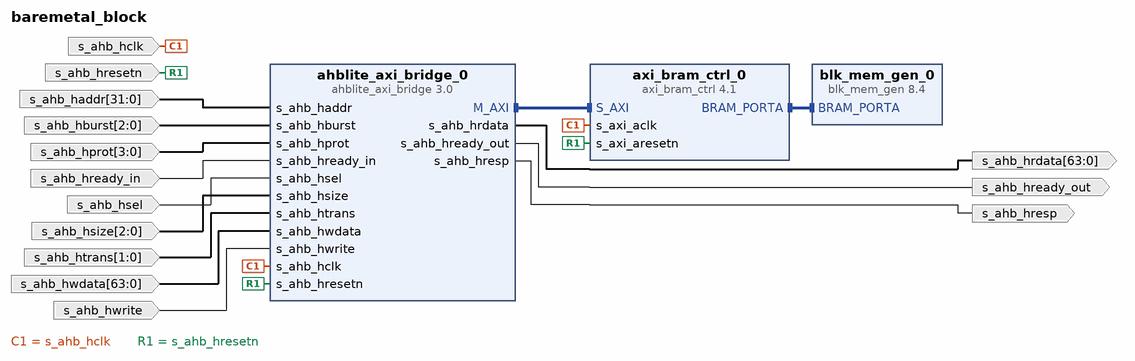
[diagram p0: block diagram of the top level]
# Vivado block design baremetal_block, xck26-sfvc784-2LV-c, Vivado 2025.1
create_bd_design baremetal_block

create_bd_port -dir I -type rst s_ahb_hresetn
create_bd_port -dir I -type clk s_ahb_hclk
set_property -dict {CONFIG.FREQ_HZ 100000000} [get_bd_ports s_ahb_hclk]
create_bd_port -dir I s_ahb_hsel
create_bd_port -dir I s_ahb_hwrite
create_bd_port -dir I -from 63 -to 0 s_ahb_hwdata
create_bd_port -dir I -from 1 -to 0 s_ahb_htrans
create_bd_port -dir I -from 2 -to 0 s_ahb_hsize
create_bd_port -dir O s_ahb_hresp
create_bd_port -dir O s_ahb_hready_out
create_bd_port -dir I s_ahb_hready_in
create_bd_port -dir O -from 63 -to 0 s_ahb_hrdata
create_bd_port -dir I -from 3 -to 0 s_ahb_hprot
create_bd_port -dir I -from 2 -to 0 s_ahb_hburst
create_bd_port -dir I -from 31 -to 0 s_ahb_haddr

create_bd_cell -type ip -vlnv xilinx.com:ip:axi_bram_ctrl:4.1 axi_bram_ctrl_0
set_property -dict {CONFIG.DATA_WIDTH 64 CONFIG.SINGLE_PORT_BRAM 1} [get_bd_cells axi_bram_ctrl_0]
create_bd_cell -type ip -vlnv xilinx.com:ip:blk_mem_gen:8.4 blk_mem_gen_0
set_property -dict [list \
  CONFIG.EN_SAFETY_CKT false \
  CONFIG.Enable_32bit_Address true \
  CONFIG.PRIM_type_to_Implement BRAM \
  CONFIG.use_bram_block BRAM_Controller \
] [get_bd_cells blk_mem_gen_0]
create_bd_cell -type ip -vlnv xilinx.com:ip:ahblite_axi_bridge:3.0 ahblite_axi_bridge_0
set_property -dict {CONFIG.C_M_AXI_DATA_WIDTH 64 CONFIG.C_S_AHB_DATA_WIDTH 64} [get_bd_cells ahblite_axi_bridge_0]

# ---- connections ----

connect_bd_intf_net [get_bd_intf_pins ahblite_axi_bridge_0/M_AXI] [get_bd_intf_pins axi_bram_ctrl_0/S_AXI]
connect_bd_intf_net [get_bd_intf_pins axi_bram_ctrl_0/BRAM_PORTA] [get_bd_intf_pins blk_mem_gen_0/BRAM_PORTA]
connect_bd_net [get_bd_pins ahblite_axi_bridge_0/s_ahb_hrdata] [get_bd_ports s_ahb_hrdata]
connect_bd_net [get_bd_pins ahblite_axi_bridge_0/s_ahb_hready_out] [get_bd_ports s_ahb_hready_out]
connect_bd_net [get_bd_pins ahblite_axi_bridge_0/s_ahb_hresp] [get_bd_ports s_ahb_hresp]
connect_bd_net [get_bd_ports s_ahb_haddr] [get_bd_pins ahblite_axi_bridge_0/s_ahb_haddr]
connect_bd_net [get_bd_ports s_ahb_hburst] [get_bd_pins ahblite_axi_bridge_0/s_ahb_hburst]
connect_bd_net [get_bd_ports s_ahb_hclk] [get_bd_pins ahblite_axi_bridge_0/s_ahb_hclk] [get_bd_pins axi_bram_ctrl_0/s_axi_aclk]
connect_bd_net [get_bd_ports s_ahb_hprot] [get_bd_pins ahblite_axi_bridge_0/s_ahb_hprot]
connect_bd_net [get_bd_ports s_ahb_hready_in] [get_bd_pins ahblite_axi_bridge_0/s_ahb_hready_in]
connect_bd_net [get_bd_ports s_ahb_hresetn] [get_bd_pins ahblite_axi_bridge_0/s_ahb_hresetn] [get_bd_pins axi_bram_ctrl_0/s_axi_aresetn]
connect_bd_net [get_bd_ports s_ahb_hsel] [get_bd_pins ahblite_axi_bridge_0/s_ahb_hsel]
connect_bd_net [get_bd_ports s_ahb_hsize] [get_bd_pins ahblite_axi_bridge_0/s_ahb_hsize]
connect_bd_net [get_bd_ports s_ahb_htrans] [get_bd_pins ahblite_axi_bridge_0/s_ahb_htrans]
connect_bd_net [get_bd_ports s_ahb_hwdata] [get_bd_pins ahblite_axi_bridge_0/s_ahb_hwdata]
connect_bd_net [get_bd_ports s_ahb_hwrite] [get_bd_pins ahblite_axi_bridge_0/s_ahb_hwrite]

validate_bd_design
save_bd_design
